# EAGLE design rotary_encoder_5 (EAGLE 8.3.2)
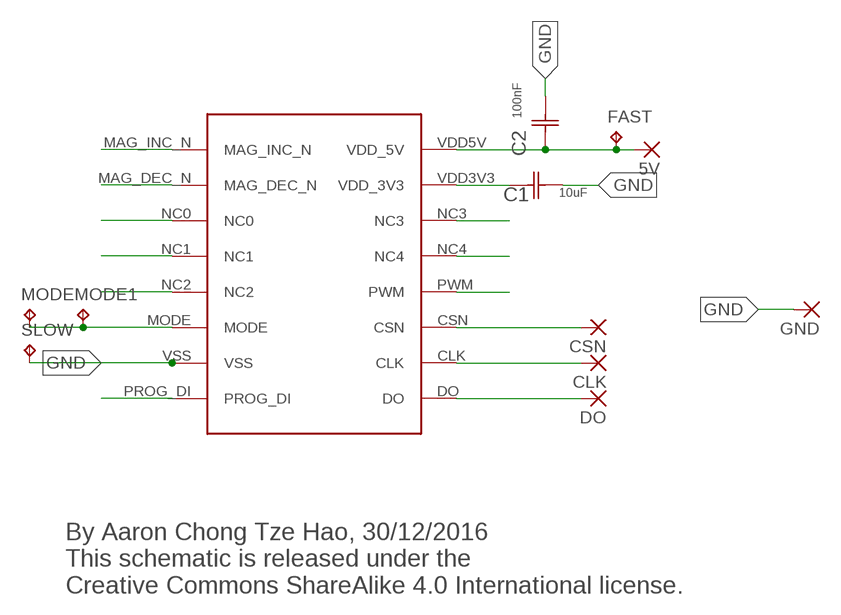
[diagram p0: schematic, sheet 1]

## Parts
5V  1,6/0,8  [1,6/0,8]
C1  10uF  CAP_0805_10UF  [CAP_0805_100NF]
C2  100nF  CAP_0805_100NF  [CAP_0805_100NF]
CLK  1,6/0,8  [1,6/0,8]
CSN  1,6/0,8  [1,6/0,8]
DO  1,6/0,8  [1,6/0,8]
FAST  TPTP10SQ  [TP10SQ]
GND  1,6/0,8  [1,6/0,8]
MODE  TPTP10SQ  [TP10SQ]
MODE1  TPTP10SQ  [TP10SQ]
SLOW  TPTP10SQ  [TP10SQ]
U$1  AS5045_ROTARY_ENCODER  [AS5045_ROTARY_ENCODER]

## Nets
5V: 5V.1(P) C2.1(C1) FAST.TP U$1.VDD5V(VDD_5V)
CLK: CLK.1(P) U$1.CLK
CSN: CSN.1(P) U$1.CSN
DO: DO.1(P) U$1.DO
GND: C1.2(C2) C2.2(C2) GND.1(P) SLOW.TP U$1.VSS
N$1: MODE1.TP MODE.TP U$1.MODE
N$2: C1.1(C1) U$1.VDD3V3(VDD_3V3)
N$3: U$1.NC3
N$4: U$1.NC4
N$5: U$1.PWM
N$9: U$1.MAG_INC_N
N$10: U$1.MAG_DEC_N
N$11: U$1.NC0
N$12: U$1.NC1
N$13: U$1.NC2
N$16: U$1.PROG_DI

## Notes on the sheet
- By Aaron Chong Tze Hao, 30/12/2016
  This schematic is released under the 
  Creative Commons ShareAlike 4.0 International license.

## Library data of the parts
5V CLK CSN DO GND = wirepad:1,6/0,8: THROUGH-HOLE PAD
C1 = cap_0805:CAP_0805_10UF: CAPACITOR, 0805; MPN: 0805F106Z100CT; OC_FARNELL: 1759421; SUPPLIER: Multicomp; TOLERANCE: -20/+80%; VOLTAGERATING: 10V
C2 = cap_0805:CAP_0805_100NF: CAPACITOR, 0805; MPN: U0805F104ZCT; OC_FARNELL: 9406409; OC_NEWARK: 38K9281; SUPPLIER: Multicomp; TOLERANCE: -20/+80%; VOLTAGERATING: 50V
FAST MODE MODE1 SLOW = testpad:TP: Test pad
U$1 = DCG_encoders:AS5045_ROTARY_ENCODER

## Board
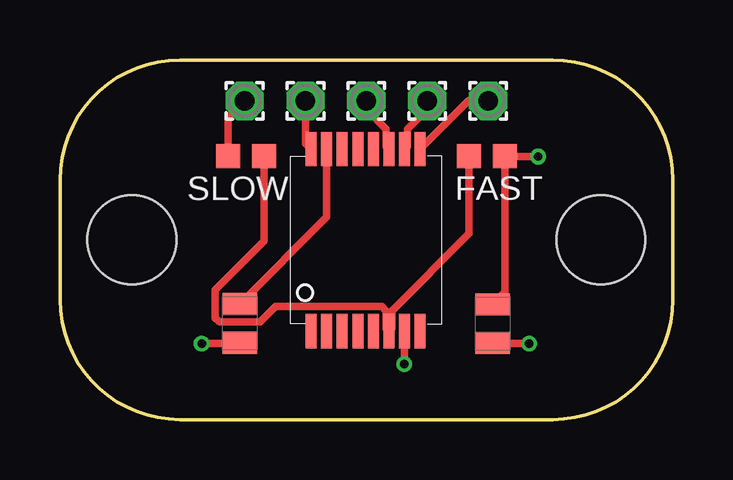
[diagram p1: board, top side]
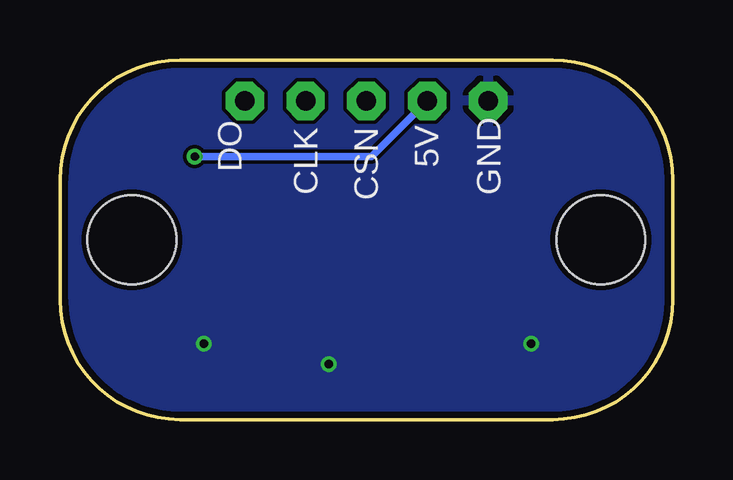
[diagram p2: board, bottom side, seen from below]

Size 25.56 x 15 mm. Coordinates in mm from the lower left corner, seen from the top.
Outline: 0,5 0,10 arc-90 5,15 20.56,15 arc-90 25.56,10 25.56,5 arc-90 20.56,0 5,0 arc-90 0,5
Copper layers (1*16): Top 0.035mm / dielectric 1.5mm / Bottom 0.035mm
Design rules "SeeedStudio_2layer_DRU_no_angle_20140221": minimum track width 6mil, minimum drill 12mil, track to track 6mil, track to pad 6mil, pad to pad 6mil, via to via 6mil, smd to smd 0mil, copper to edge 10mil, drill to drill 10mil, minimum pad ring 10mil, minimum via ring 6mil, stop-mask expansion 2mil, vias tented up to drill 100mil, thermal gap 10mil
Holes 3.7 mm at 3,7.5 22.56,7.5

### Footprints (pad centres in the part's own frame; a part is rotated, then mirrored left to right if it is on the bottom)
1,6/0,8 = drill 0.813 pad 1.6 octagon: 1 0,0
CAP_0805_100NF = smd 0.914 x 1.448: 1 -0.813,0; 2 0.813,0
TP10SQ = smd 1 x 1: TP 0,0
AS5045_ROTARY_ENCODER = smd 1.43 x 0.46: CLK 3.78,-1.59; CSN 3.78,-0.94; DO 3.78,-2.24; MAG_DEC_N -3.81,1.66; MAG_INC_N -3.81,2.31; MODE -3.81,-0.94; NC0 -3.81,1.01; NC1 -3.81,0.36; NC2 -3.81,-0.29; NC3 3.78,1.01; NC4 3.78,0.36; PROG_DI -3.81,-2.24; PWM 3.78,-0.29; VDD3V3 3.78,1.66; VDD5V 3.78,2.31; VSS -3.81,-1.59

### Placement (x,y rotation side)
5V  10.24,13.3 0 top
C1  7.5,4.02 270 top
C2  18.05,4 270 top
CLK  15.32,13.3 0 top
CSN  12.78,13.3 0 top
DO  17.86,13.3 0 top
FAST  18.56,11 0 top
GND  7.7,13.3 0 top
MODE  8.5,10.99 0 top
MODE1  17.06,11 0 top
SLOW  7,10.99 0 top
U$1  12.78,7.5 90 top

### Tracks (layer width: path | path; a pad name or v marks a point on that pad's centre or on a via)
5V  (via drill 0.35)
  Top 0.305: U$1.VDD5V 10.24,11.51 5V.1 | C2.1 18.56,5.33 FAST.TP 18.59,10.97 v19.94,10.97 | v19.94,10.97 v19.95,10.97 v19.94,10.97
  Bottom 0.305: v19.94,10.97 12.57,10.97 5V.1
CLK
  Top 0.305: U$1.CLK 14.48,11.39 14.48,12.12 15.32,12.96 CLK.1
CSN
  Top 0.305: U$1.CSN 13.6,11.39 13.6,12.12 12.78,12.95 CSN.1
DO
  Top 0.305: U$1.DO 17.04,13.3 DO.1
GND  (via drill 0.35)
  Top 0.305: C1.2 7.47,3.18 v5.91,3.18 v5.91,3.17 | C2.2 18.06,3.17 v19.56,3.17 | U$1.VSS 14.36,2.41 14.35,2.4 v14.35,2.31 | SLOW.TP 7,12.6 GND.1
  pour Bottom: 0.2,0.1 25.54,0.14 25.54,14.93 0.2,14.89
N$1
  Top 0.305: MODE1.TP 17.06,7.75 13.83,4.53 13.83,3.81 U$1.MODE 13.6,3.81 13.6,4.53 13.43,4.71 8.99,4.71 8.35,4.07 6.65,4.07 6.47,4.25 6.47,5.42 8.5,7.45 MODE.TP
N$2
  Top 0.305: C1.1 11.12,8.45 U$1.VDD3V3

### Text on the board
Document: By Aaron Chong Tze Hao, 30/12/2016 / This board file is released under the / Creative Commons ShareAlike 4.0 International license.